# EAGLE design xx backplane shield xi (EAGLE 8.3.2)
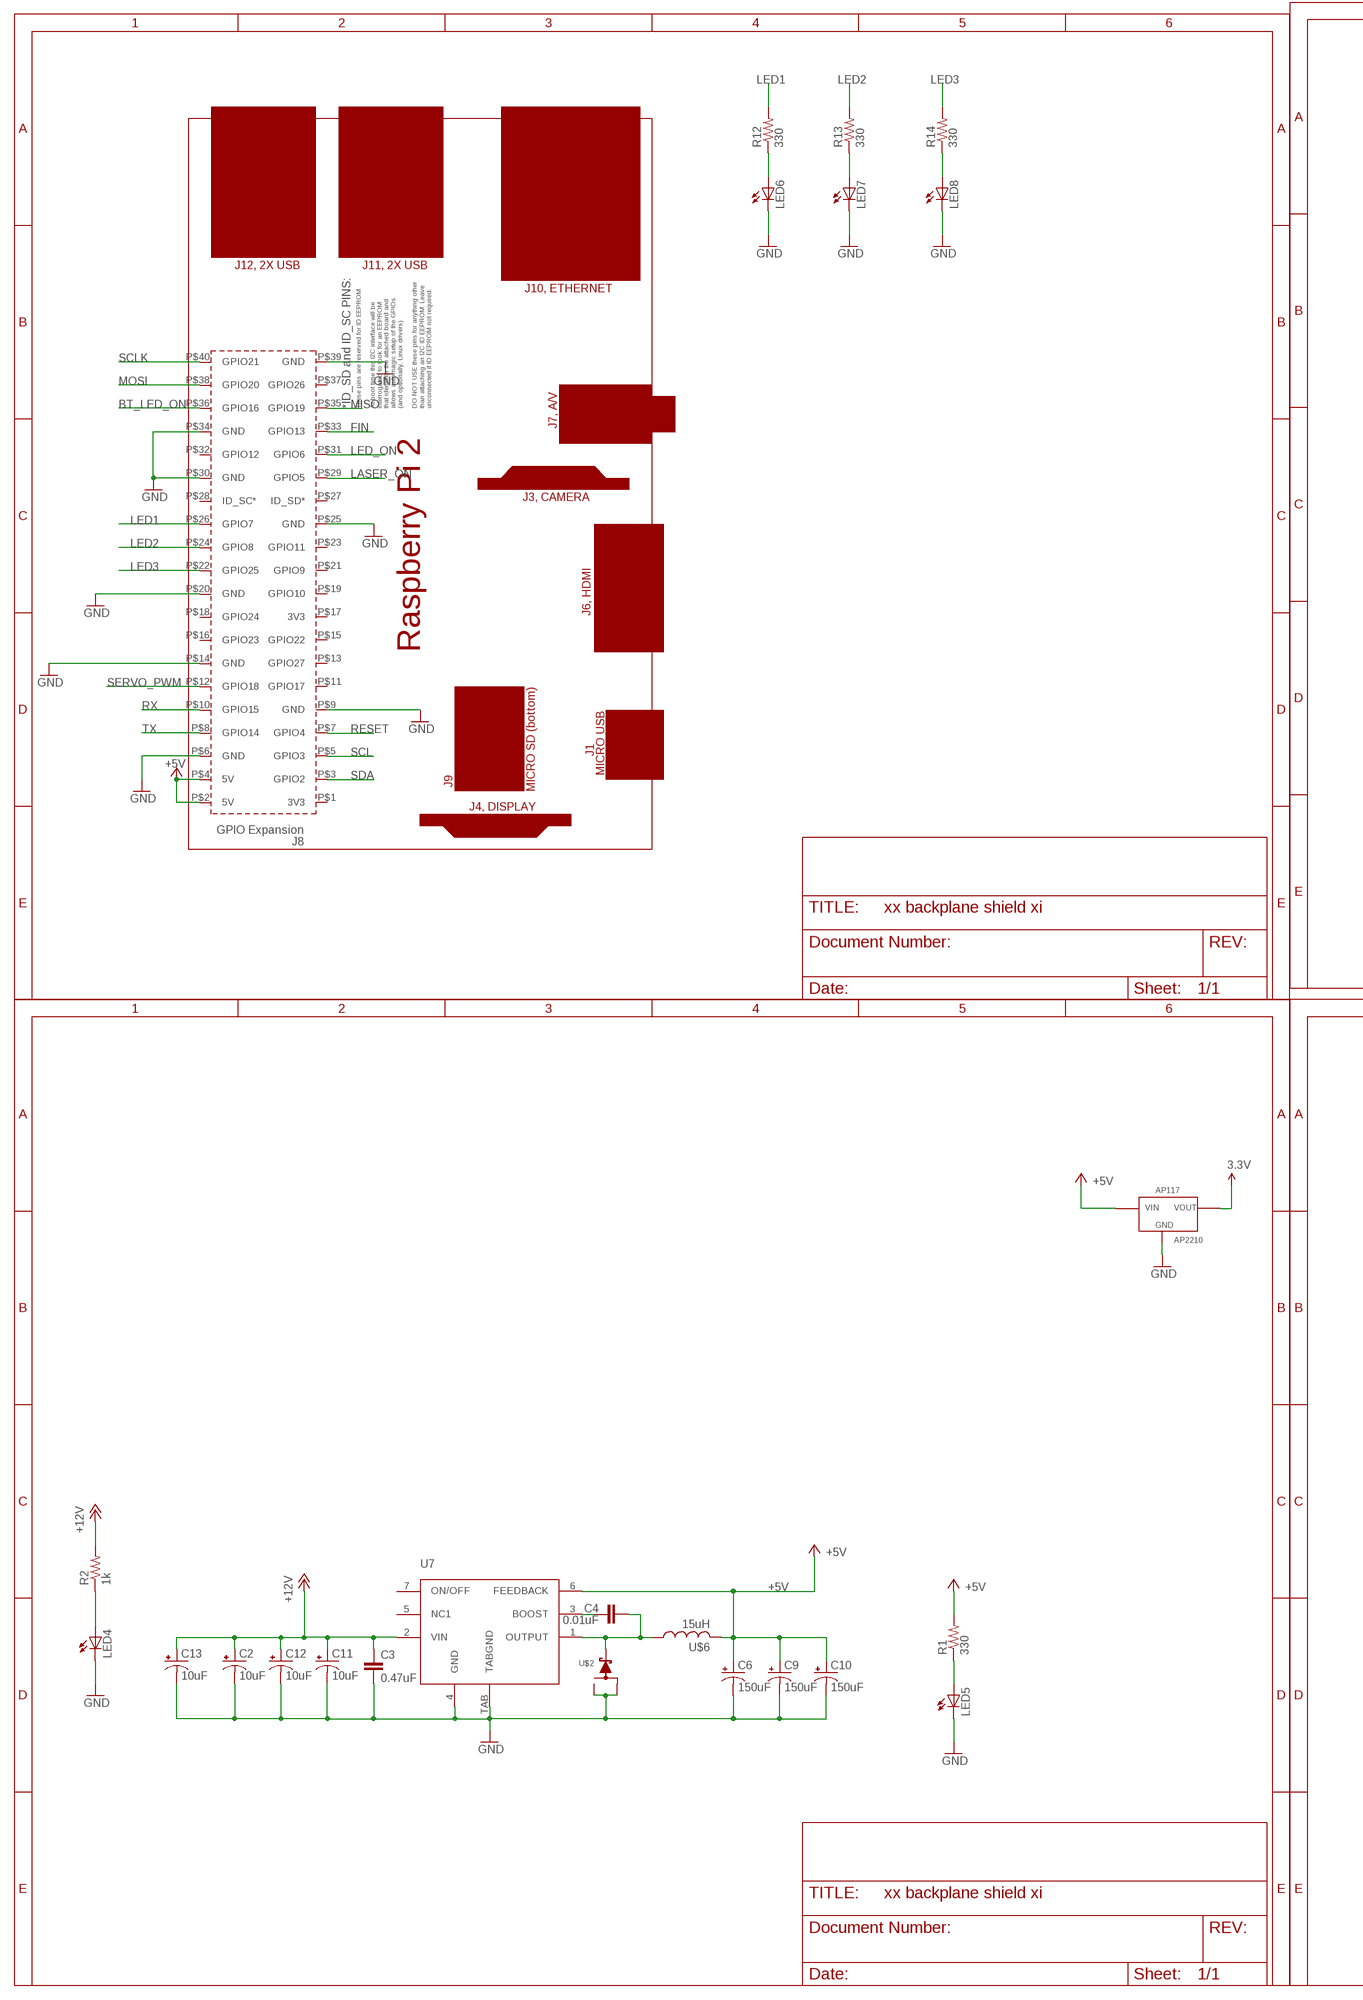
[diagram p0: schematic, sheet 1, part 1 of 2]
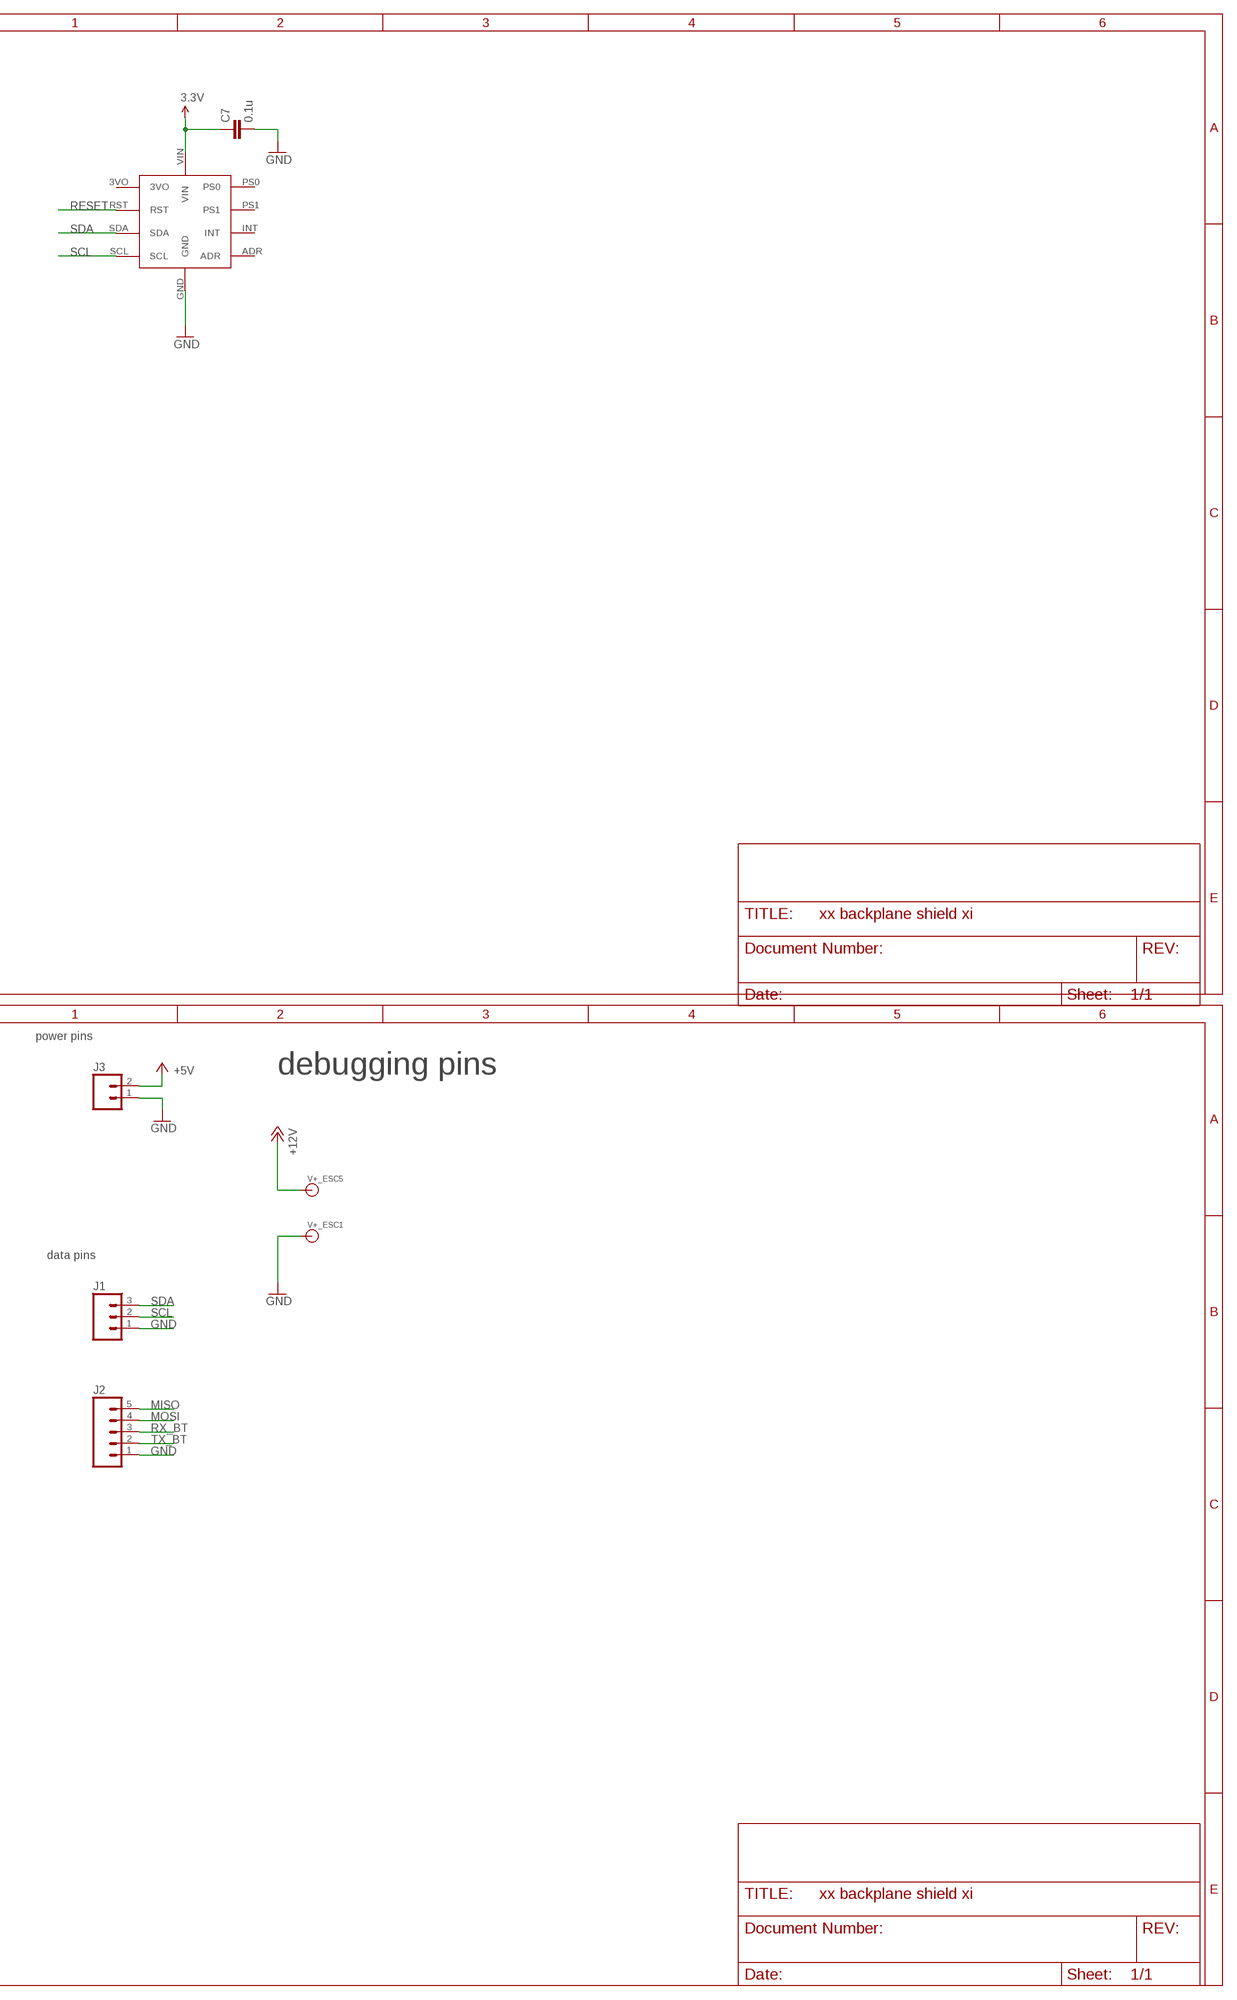
[diagram p1: schematic, sheet 1, part 2 of 2]

## Parts
C2  10uF  C-TANTALUM(10UF_150UF)  [CTAN(7.30_4.30MM)]
C3  0.47uF  0.18UF-0603-10V-10%  [0603]
C4  0.01uF  CAP0603-CAP  [0603-CAP]
C6  150uF  C-TANTALUM(10UF_150UF)  [CTAN(7.30_4.30MM)]
C7  0.1u  CAP0603-CAP  [0603-CAP]
C9  150uF  C-TANTALUM(10UF_150UF)  [CTAN(7.30_4.30MM)]
C10  150uF  C-TANTALUM(10UF_150UF)  [CTAN(7.30_4.30MM)]
C11  10uF  C-TANTALUM(10UF_150UF)  [CTAN(7.30_4.30MM)]
C12  10uF  C-TANTALUM(10UF_150UF)  [CTAN(7.30_4.30MM)]
C13  10uF  C-TANTALUM(10UF_150UF)  [CTAN(7.30_4.30MM)]
J1  M03PTH  [1X03]
J2  M05PTH  [1X05]
J3  M02PTH  [1X02]
LED4  LEDSML0603  [SML0603]
LED5  LEDSML0603  [SML0603]
LED6  LEDSML0603  [SML0603]
LED7  LEDSML0603  [SML0603]
LED8  LEDSML0603  [SML0603]
PCB1  RPI2  [RPI2]
R1  330  R-US_R0603  [R0603]
R2  1k  R-US_R0603  [R0603]
R12  330  R-US_R0603  [R0603]
R13  330  R-US_R0603  [R0603]
R14  330  R-US_R0603  [R0603]
U7  LM2678  [LM2678]
U$2  SWITCHMODE_SCHOTTKY  [DPAK-3]
U$3  BNO055_9DOF_BREAKOUT  [BNO055]
U$5  AP2210  [SOT-23-3]
U$6  15uH  HCMA1305  [HCMA1305]
V+_ESC1  BANANA_CONN  [BANANA_CONN]
V+_ESC5  BANANA_CONN  [BANANA_CONN]

## Nets
3.3V: C7.1 U$3.VIN U$5.VOUT
+5V: C6.+ C9.+ C10.+ J3.2 PCB1.P$2(5V) PCB1.P$4(5V) R1.2 U7.6(FEEDBACK) U$5.VIN U$6.P$2
+12V: C2.+ C3.1 C11.+ C12.+ C13.+ R2.2 U7.2(VIN) V+_ESC5.P$1
BT_LED_ON: PCB1.P$36(GPIO16)
FIN: PCB1.P$33(GPIO13)
GND: C2.- C3.2 C6.- C7.2 C9.- C10.- C11.- C12.- C13.- J1.1 J2.1 J3.1 LED4.C LED5.C LED6.C LED7.C LED8.C PCB1.P$6(GND) PCB1.P$9(GND) PCB1.P$14(GND) PCB1.P$20(GND) PCB1.P$25(GND) PCB1.P$30(GND) PCB1.P$34(GND) PCB1.P$39(GND) U7.4(GND) U7.TAB(TABGND) U$2.P$1 U$2.P$3 U$3.GND U$5.GND V+_ESC1.P$1
LASER_ON: PCB1.P$29(GPIO5)
LED1: PCB1.P$26(GPIO7) R12.2
LED2: PCB1.P$24(GPIO8) R13.2
LED3: PCB1.P$22(GPIO25) R14.2
LED_ON: PCB1.P$31(GPIO6)
MISO: J2.5 PCB1.P$35(GPIO19)
MOSI: J2.4 PCB1.P$38(GPIO20)
N$2: LED5.A R1.1
N$3: LED4.A R2.1
N$13: LED6.A R12.1
N$14: LED7.A R13.1
N$15: LED8.A R14.1
N$18: C4.1 U7.3(BOOST)
N$19: C4.2 U7.1(OUTPUT) U$2.P$4 U$6.P$1
RESET: PCB1.P$7(GPIO4) U$3.RST
RX: PCB1.P$10(GPIO15)
RX_BT: J2.3
SCL: J1.2 PCB1.P$5(GPIO3) U$3.SCL
SCLK: PCB1.P$40(GPIO21)
SDA: J1.3 PCB1.P$3(GPIO2) U$3.SDA
SERVO_PWM: PCB1.P$12(GPIO18)
TX: PCB1.P$8(GPIO14)
TX_BT: J2.2
Unconnected: PCB1.P$1(3V3) PCB1.P$11(GPIO17) PCB1.P$13(GPIO27) PCB1.P$15(GPIO22) PCB1.P$16(GPIO23) PCB1.P$17(3V3) PCB1.P$18(GPIO24) PCB1.P$19(GPIO10) PCB1.P$21(GPIO9) PCB1.P$23(GPIO11) PCB1.P$27(ID_SD*) PCB1.P$28(ID_SC*) PCB1.P$32(GPIO12) PCB1.P$37(GPIO26) U7.5(NC1) U7.7(ON/OFF) U$3.3VO U$3.ADR U$3.INT U$3.PS0 U$3.PS1

## Notes on the sheet
- power pins
- debugging pins
- data pins

## Library data of the parts
C2 C6 C9-C13 = PowerComponents:C-TANTALUM(10UF_150UF)
C3 = SparkFun-Capacitors:0.18UF: 0.18µF ceramic capacitor A capacitor is a passive two-terminal electrical component used to store electrical energy temporarily in an electric field.; PROD_ID: CAP-12380; VALUE: 0.18uF
C4 C7 = SparkFun-Passives:CAP: Capacitor Standard 0603 ceramic capacitor, and 0.1" leaded capacitor.
J1 = SparkFun-Connectors:M03: Header 3 Standard 3-pin 0.1" header. Use with straight break away headers (SKU : PRT-00116), right angle break away headers (PRT-00553), swiss pins (PRT-00743), machine pins (PRT-00117), and female headers (PRT-00115). Molex polarized connector foot print use with SKU : PRT-08232 with associated crimp pins and housings.
J2 = SparkFun-Connectors:M05: Header 5 Standard 5-pin 0.1" header. Use with straight break away headers (SKU : PRT-00116), right angle break away headers (PRT-00553), swiss pins (PRT-00743), machine pins (PRT-00117), and female headers (PRT-00115). Molex polarized connector foot print use with SKU : PRT-08230 with associated crimp pins and housings.
J3 = SparkFun-Connectors:M02: Standard 2-pin 0.1" header. Use with - straight break away headers ( PRT-00116) - right angle break away headers (PRT-00553) - swiss pins (PRT-00743) - machine pins (PRT-00117) - female headers (PRT-00115) Molex polarized connector foot print use with: PRT-08233 with associated crimp pins and housings. 2.54_SCREWTERM for use with PRT-10571. 3.5mm Screw Terminal footprints for PRT-08084 5mm Screw Terminal footprints for use with PRT-08432
LED4-LED8 = led:LED: LED OSRAM: - CHIPLED LG R971, LG N971, LY N971, LG Q971, LY Q971, LO R971, LY R971 LH N974, LH R974 LS Q976, LO Q976, LY Q976 LO Q996 - Hyper CHIPLED LW Q18S LB Q993, LB Q99A, LB R99A - SideLED LS A670, LO A670, LY A670, LG A670, LP A670 LB A673, LV A673, LT A673, LW A673 LH A674 LY A675 LS A676, LA A676, LO A676, LY A676, LW A676 LS A679, LY A679, LG A679 - Hyper Micro SIDELED® LS Y876, LA Y876, LO Y876, LY Y876 LT Y87S - SmartLED LW L88C, LW L88S LB L89C, LB L89S, LG L890 LS L89K, LO L89K, LY L89K LS L896, LA L896, LO L896, LY L896 - TOPLED LS T670, LO T670, LY T670, LG T670, LP T670 LSG T670, LSP T670, LSY T670, LOP T670, LYG T670 LG T671, LOG T671, LSG T671 LB T673, LV T673, LT T673, LW T673 LH T674 LS T676, LA T676, LO T676, LY T676, LB T676, LH T676, LSB T676, LW T676 LB T67C, LV T67C, LT T67C, LS T67K, LO T67K, LY T67K, LW E67C LS E67B, LA E67B, LO E67B, LY E67B, LB E67C, LV E67C, LT E67C LW T67C LS T679, LY T679, LG T679 LS T770, LO T770, LY T770, LG T770, LP T770 LB T773, LV T773, LT T773, LW T773 LH T774 LS E675, LA E675, LY E675, LS T675 LS T776, LA T776, LO T776, LY T776, LB T776 LHGB T686 LT T68C, LB T68C - Hyper Mini TOPLED® LB M676 - Mini TOPLED Santana® LG M470 LS M47K, LO M47K, LY M47K Source: http://www.osram.convergy.de LUXEON: - LUMILED® LXK2-PW12-R00, LXK2-PW12-S00, LXK2-PW14-U00, LXK2-PW14-V00 LXK2-PM12-R00, LXK2-PM12-S00, LXK2-PM14-U00 LXK2-PE12-Q00, LXK2-PE12-R00, LXK2-PE12-S00, LXK2-PE14-T00, LXK2-PE14-U00 LXK2-PB12-K00, LXK2-PB12-L00, LXK2-PB12-M00, LXK2-PB14-N00, LXK2-PB14-P00, LXK2-PB14-Q00 LXK2-PR12-L00, LXK2-PR12-M00, LXK2-PR14-Q00, LXK2-PR14-R00 LXK2-PD12-Q00, LXK2-PD12-R00, LXK2-PD12-S00 LXK2-PH12-R00, LXK2-PH12-S00 LXK2-PL12-P00, LXK2-PL12-Q00, LXK2-PL12-R00 Source: www.luxeon.com KINGBRIGHT: KA-3528ASYC Source: www.kingbright.com
PCB1 = MicrocontrollerComponents:RPI2: Device for Raspberry Pi 2 board created by www.element14.com More information and support community is available at http://www.element14.com/community/community/raspberry-pi/raspberrypi2
R1 R2 R12-R14 = resistor:R-US_: RESISTOR, American symbol
U7 = PowerComponents:LM2678: LM2678 Buck Converter IC 12V-to-5V
U$2 = PowerComponents:SWITCHMODE_SCHOTTKY: {Digi-Key Part Number: MBRD835LT4GOSCT-ND} {Voltage - DC Reverse (Vr) (Max): 35V} {Current - Average Rectified (Io): 8A} {Voltage - Forward (Vf) (Max) @ If: 510mV @ 8A} {Speed: Fast Recovery =< 500ns, > 200mA (Io)} {Current - Reverse Leakage @ Vr: 1.4mA @ 35V} {Mounting Type: Surface Mount} {Package / Case: TO-252-3, DPak (2 Leads + Tab), SC-63} {Supplier Device Package: DPAK-3} {Operating Temperature - Junction: -65°C ~ 150°C}
U$3 = Other:BNO055_9DOF_BREAKOUT
U$5 = PowerComponents:AP2210
U$6 = DiscreteComponents:HCMA1305
V+_ESC1 V+_ESC5 = SparkFun-Connectors:BANANA_CONN: Through-hole banana jack

## Board
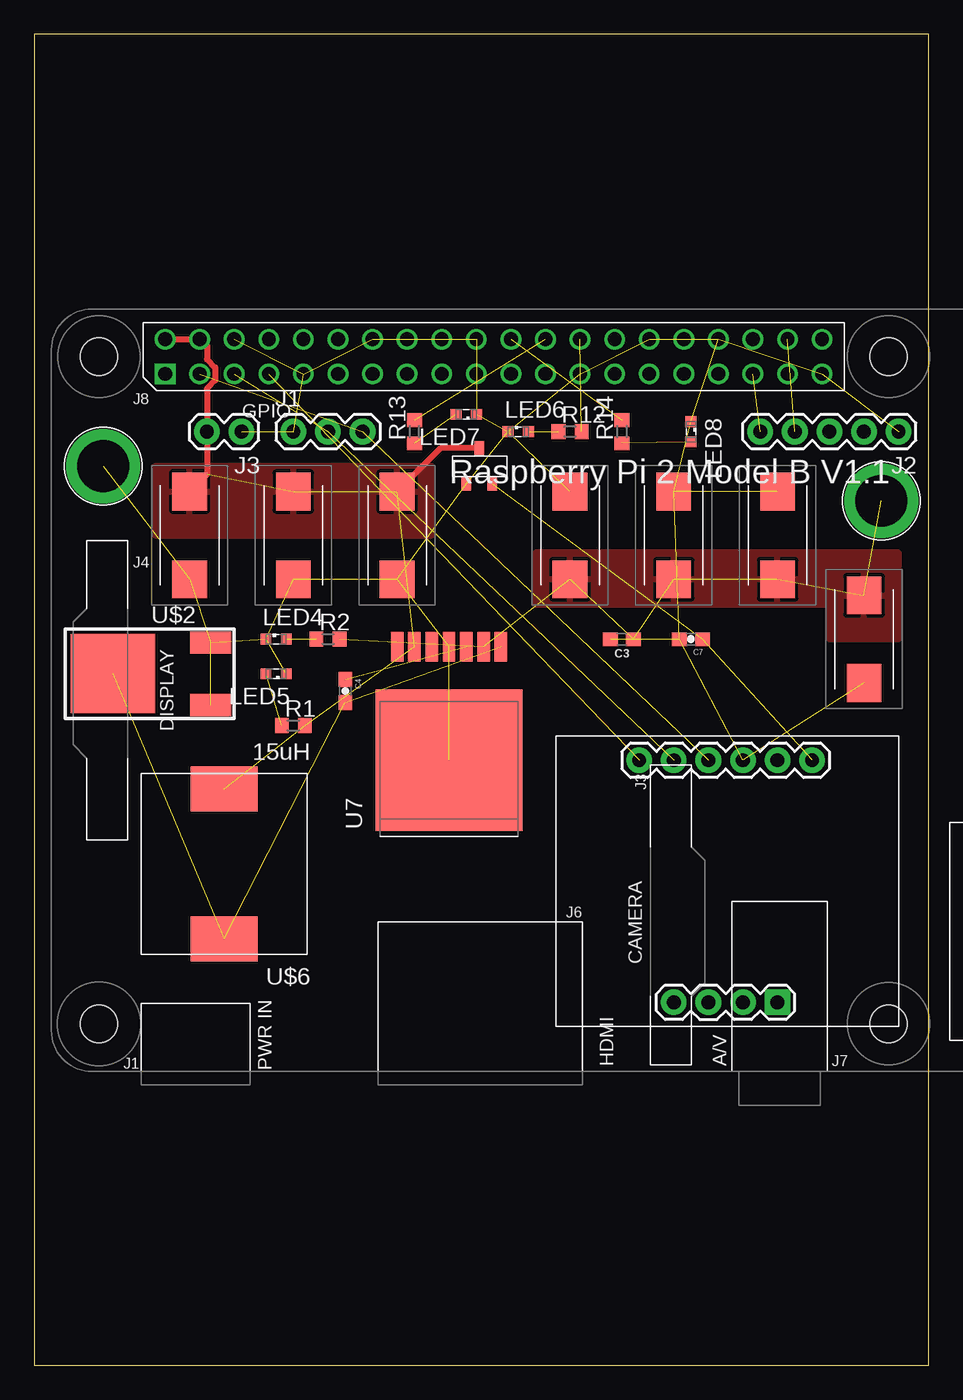
[diagram p2: board, top side]

Size 65.71 x 97.78 mm. Coordinates in mm from the lower left corner, seen from the top.
Outline: 0,0 65.71,0 65.71,97.78 0,97.78 0,0
Copper layers (1*16): Top 0.035mm / dielectric 1.5mm / Bottom 0.035mm
Design rules "default": minimum track width 6mil, minimum drill 0.35mm, track to track 6mil, track to pad 6mil, pad to pad 6mil, via to via 6mil, smd to smd 6mil, copper to edge 40mil, drill to drill 6mil, minimum pad ring 10mil, minimum via ring 8mil, stop-mask expansion 4mil, vias tented up to drill 0mil, thermal gap 10mil

### Footprints (pad centres in the part's own frame; a part is rotated, then mirrored left to right if it is on the bottom)
CTAN(7.30_4.30MM) = smd 2.77 x 2.55: + -3.22,0; - 3.22,0
0603 = smd 1.1 x 1: 1 -0.85,0; 2 0.85,0
0603-CAP = smd 1.1 x 1: 1 -0.85,0; 2 0.85,0
1X03 = drill 1.016 pad 1.88: 1 0,0; 2 2.54,0; 3 5.08,0
1X05 = drill 1.016 pad 1.88: 1 0,0; 2 2.54,0; 3 5.08,0; 4 7.62,0; 5 10.16,0
1X02 = drill 1.016 pad 1.88: 1 0,0; 2 2.54,0
SML0603 = smd 0.8 x 0.8: A 0.75,0; C -0.75,0
RPI2 = drill 1.016 square: P$1 8.37,51.23 | drill 1.016: P$2 8.357,53.772; P$3 10.897,51.232; P$4 10.897,53.772; P$5 13.437,51.232; P$6 13.437,53.772; P$7 15.977,51.232; P$8 15.977,53.772; P$9 18.517,51.232; P$10 18.517,53.772; P$11 21.057,51.232; P$12 21.057,53.772; P$13 23.597,51.232; P$14 23.597,53.772; P$15 26.137,51.232; P$16 26.137,53.772; P$17 28.677,51.232; P$18 28.677,53.772; P$19 31.217,51.232; P$20 31.217,53.772; P$21 33.757,51.232; P$22 33.757,53.772; P$23 36.297,51.232; P$24 36.297,53.772; P$25 38.837,51.232; P$26 38.837,53.772; P$27 41.377,51.232; P$28 41.377,53.772; P$29 43.917,51.232; P$30 43.917,53.772; P$31 46.457,51.232; P$32 46.457,53.772; P$33 48.997,51.232; P$34 48.997,53.772; P$35 51.537,51.232; P$36 51.537,53.772; P$37 54.077,51.232; P$38 54.077,53.772; P$39 56.617,51.232; P$40 56.617,53.772 | hole 2.75: 3.5,3.5; 61.5,3.5; 3.5,52.5; 61.5,52.5
R0603 = smd 1 x 1.1: 1 -0.85,0; 2 0.85,0
LM2678 = smd 2.159 x 0.914: 1 8.331,-3.81; 2 8.331,-2.54; 3 8.331,-1.27; 4 8.331,0; 5 8.331,1.27; 6 8.331,2.54; 7 8.331,3.81 | smd 10.414 x 10.795: TAB 0,0
DPAK-3 = smd 3 x 1.6: P$1 4.08,-2.285; P$3 4.08,2.285 | smd 6.2 x 5.8: P$4 -3.1,0
BNO055 = drill 1.016 pad 1.88: 3VO -8.89,2.54; ADR 8.89,-5.08; GND -8.89,0; INT 8.89,-2.54; PS1 8.89,0; RST -8.89,-7.62; SCL -8.89,-5.08; SDA -8.89,-2.54; VIN -8.89,5.08 | drill 1.016 pad 1.88 square: PS0 8.89,2.54
SOT-23-3 = smd 0.7 x 1: GND 0,0; VIN 0.95,2.6; VOUT 1.9,0
HCMA1305 = smd 4.9 x 3.3: P$1 0,5.5; P$2 0,-5.5
BANANA_CONN = drill 3.81 pad 5.461: P$1 0,0

### Placement (x,y rotation side)
C2  60.96,53.34 270 top
C3  43.18,53.34 180 top
C4  22.86,49.53 270 top
C6  19.05,60.96 270 top
C7  48.26,53.34 180 top
C9  26.67,60.96 270 top
C10  11.43,60.96 270 top
C11  46.99,60.96 90 top
C12  54.61,60.96 90 top
C13  39.37,60.96 90 top
J1  19.05,68.58 0 top
J2  63.5,68.58 180 top
J3  15.24,68.58 180 top
LED4  17.78,53.34 0 top
LED5  17.78,50.8 180 top
LED6  35.56,68.58 0 top
LED7  31.75,69.85 180 top
LED8  48.26,68.58 270 top
PCB1  1.27,21.59 0 top
R1  19.05,46.99 0 top
R2  21.59,53.34 0 top
R12  39.37,68.58 0 top
R13  27.94,68.58 90 top
R14  43.18,68.58 90 top
U7  30.48,44.45 90 top
U$2  8.89,50.8 0 top
U$3  52.07,35.56 270 top
U$5  31.75,64.77 0 top
U$6  13.97,36.83 180 top
V+_ESC1  5.08,66.04 0 top
V+_ESC5  62.23,63.5 0 top

### Tracks (layer width: path | path; a pad name or v marks a point on that pad's centre or on a via)
3.3V  (2 unrouted)
+5V  (5 unrouted)
  Top 0.457: PCB1.P$2 PCB1.P$4 12.27,75.36 12.7,74.93 12.7,73.91 13.31,73.3 13.31,72.35 12.7,71.74 J3.2 12.7,65.45 C10.+ | U$5.VIN 29.86,67.37 C9.+
  pour Top: 8.89,66.04 8.89,60.96 29.21,60.96 29.21,66.04
+12V  (7 unrouted)
  pour Top: 36.83,59.69 36.83,55.88 58.42,55.88 58.42,53.34 63.5,53.34 63.5,59.69
GND  (31 unrouted)
LED1  (1 unrouted)
LED2  (1 unrouted)
LED3  (1 unrouted)
MISO  (1 unrouted)
MOSI  (1 unrouted)
N$2  (1 unrouted)
N$3  (1 unrouted)
N$13  (1 unrouted)
N$14  (1 unrouted)
N$15  (1 unrouted)
N$18  (1 unrouted)
N$19  (3 unrouted)
RESET  (1 unrouted)
SCL  (2 unrouted)
SDA  (2 unrouted)